# EAGLE schematic IOTBee-v1.1 (EAGLE 6.6.0)
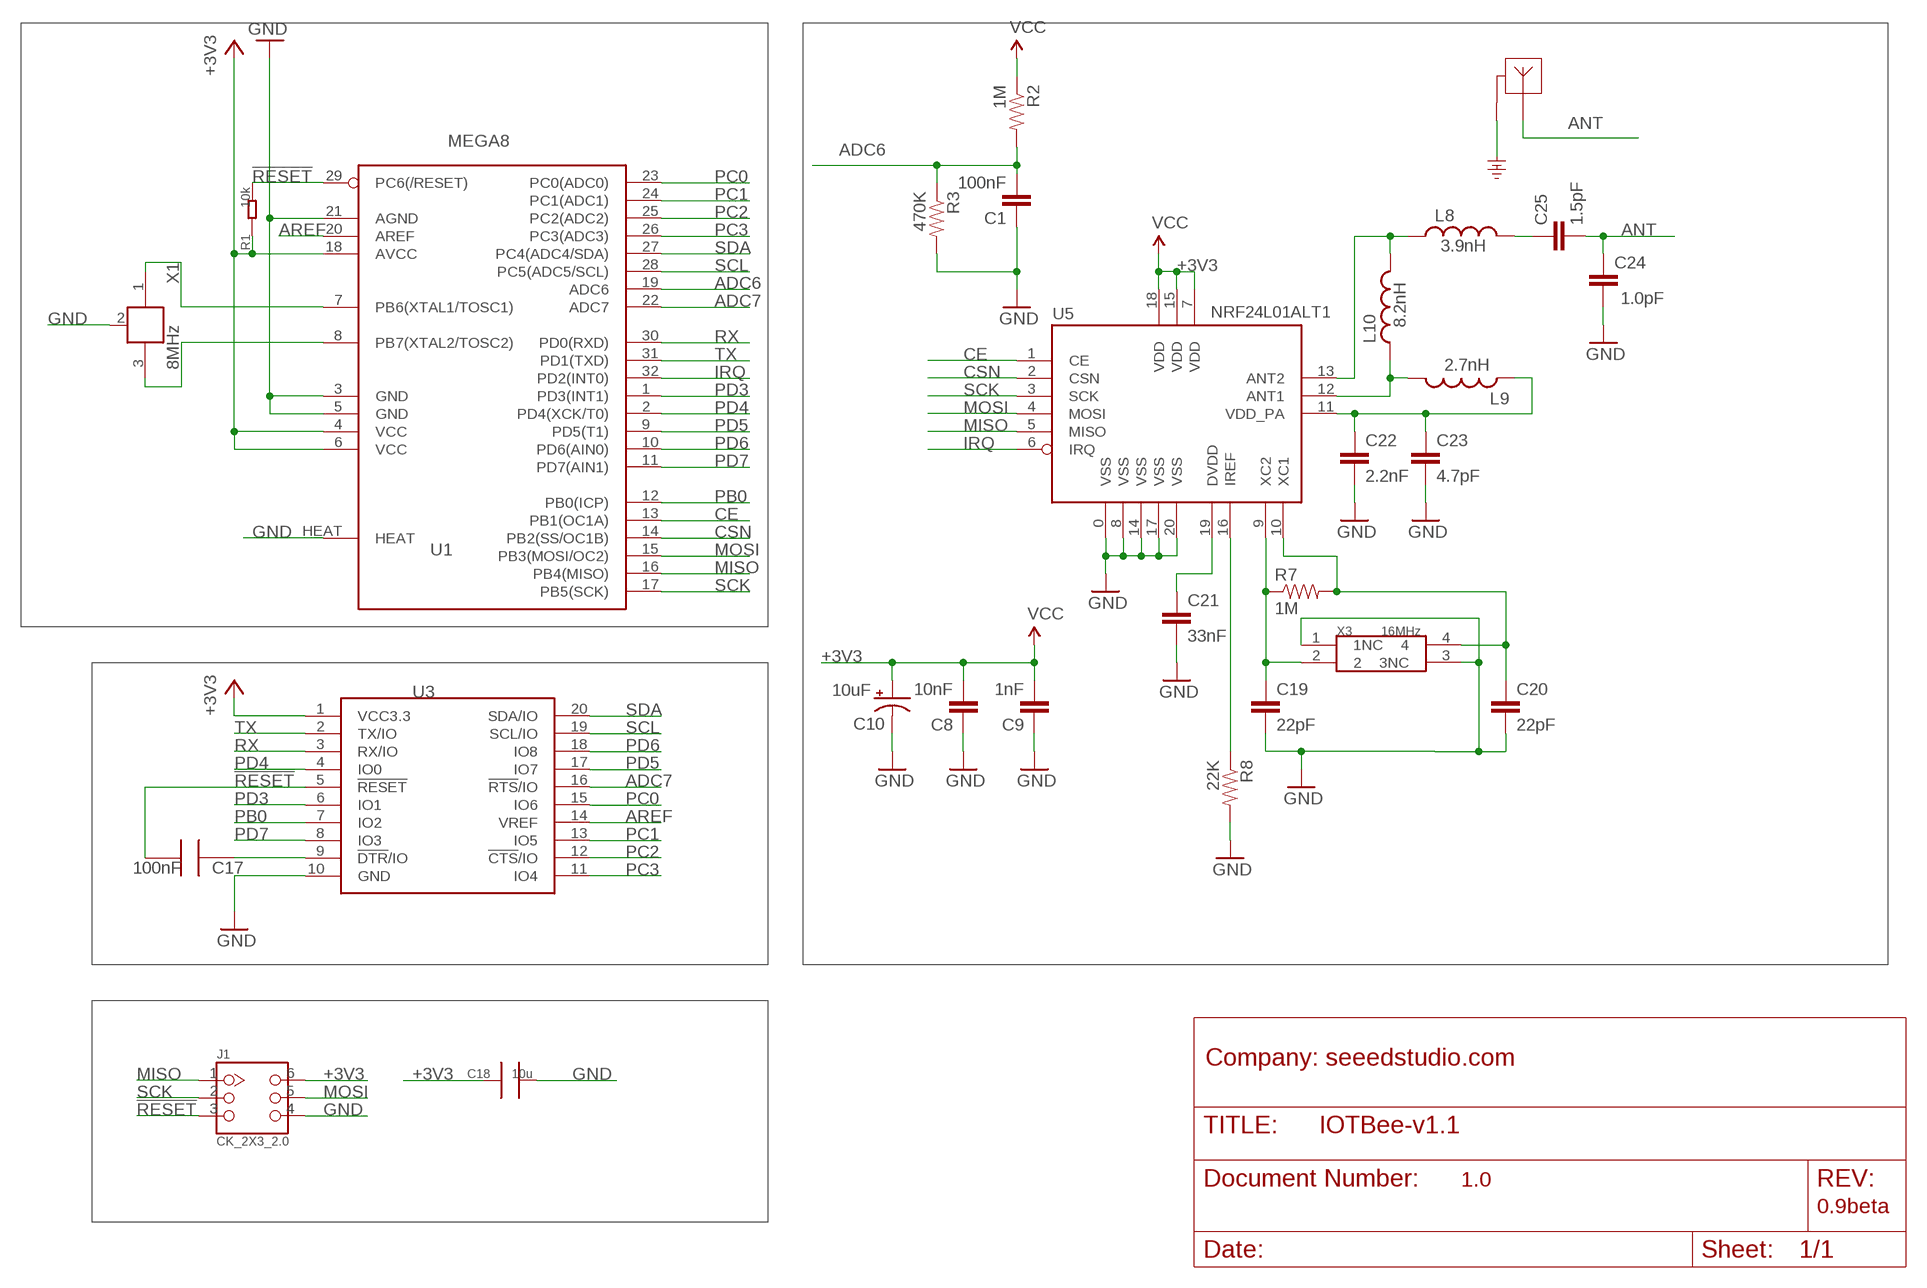
[diagram p0: schematic, sheet 1]

## Parts
ANT1  2.4G-ANT  [2.4G-ANT]
C1  100nF  CAP0402-CAP  [0402-CAP]
C8  10nF  CAP0402-CAP  [0402-CAP]
C9  1nF  CAP0402-CAP  [0402-CAP]
C10  10uF  CAP_POL3528  [EIA3528]
C17  100nF  C0603_S  [0603_S]
C18  10u  C0805  [0805]
C19  22pF  CAP0402-CAP  [0402-CAP]
C20  22pF  CAP0402-CAP  [0402-CAP]
C21  33nF  CAP0402-CAP  [0402-CAP]
C22  2.2nF  CAP0402-CAP  [0402-CAP]
C23  4.7pF  CAP0402-CAP  [0402-CAP]
C24  1.0pF  CAP0402-CAP  [0402-CAP]
C25  1.5pF  CAP0402-CAP  [0402-CAP]
J1  CK_2X3_2.0  [CK_2X3_2.0]
L8  3.9nH  INDUCTOR0402  [C0402]
L9  2.7nH  INDUCTOR0402  [C0402]
L10  8.2nH  INDUCTOR0402  [C0402]
R1  10k  R0603_S  [0603_S]
R2  1M  RESISTOR0402-RES  [0402-RES]
R3  470K  RESISTOR0402-RES  [0402-RES]
R7  1M  RESISTOR0402-RES  [0402-RES]
R8  22K  RESISTOR0402-RES  [0402-RES]
U1  MEGA8  [MLF32X]
U3  BEE-OPENBEE-BTSMD  [20P-SMD-2.0-BT]
U5  NRF24L01ALT1  [QFN20_ALT1]
X1  8MHz  XTAL_NCVER  [XTAL_3X2]
X3  16MHz  XTAL_SMD_3225  [X3225]

## Nets
!RESET: C17.2 J1.3 R1.2 U1.29(PC6(/RESET)) U3.5(!RESET)
+3V3: C8.2 C9.2 C10.A(+) C18.1 J1.6 R1.1 R2.1 U1.4(VCC) U1.6(VCC) U1.18(AVCC) U3.1(VCC3.3) U5.7(VDD) U5.15(VDD) U5.18(VDD) ; supply symbol labelled VCC
ADC6: C1.2 R2.2 R3.1 U1.19(ADC6)
ADC7: U1.22(ADC7) U3.16(!RTS!/IO)
ANT: ANT1.2 C24.2 C25.2
AREF: U1.20(AREF) U3.14(VREF)
CE: U1.13(PB1(OC1A)) U5.1(CE)
CSN: U1.14(PB2(SS/OC1B)) U5.2(CSN)
DTR: C17.1 U3.9(!DTR!/IO)
GND: ANT1.1 C1.1 C8.1 C9.1 C10.C(-) C18.2 C19.2 C20.2 C21.2 C22.2 C23.2 C24.1 J1.4 R3.2 R8.2 U1.3(GND) U1.5(GND) U1.21(AGND) U1.HEAT U3.10(GND) U5.0(VSS) U5.8(VSS) U5.14(VSS) U5.17(VSS) U5.20(VSS) X1.2(GND) X3.1(1NC) X3.3(3NC)
IRQ: U1.32(PD2(INT0)) U5.6(IRQ)
MISO: J1.1 U1.16(PB4(MISO)) U5.5(MISO)
MOSI: J1.5 U1.15(PB3(MOSI/OC2)) U5.4(MOSI)
N$11: U1.7(PB6(XTAL1/TOSC1)) X1.1
N$13: U1.8(PB7(XTAL2/TOSC2)) X1.3
N$19: C19.1 R7.1 U5.9(XC2) X3.2
N$20: C20.1 R7.2 U5.10(XC1) X3.4
N$22: L8.1 L10.2 U5.13(ANT2)
N$23: C22.1 C23.1 L9.1 U5.11(VDD_PA)
N$24: R8.1 U5.16(IREF)
N$25: C21.1 U5.19(DVDD)
N$26: L9.2 L10.1 U5.12(ANT1)
N$27: C25.1 L8.2
PB0: U1.12(PB0(ICP)) U3.7(IO2)
PC0: U1.23(PC0(ADC0)) U3.15(IO6)
PC1: U1.24(PC1(ADC1)) U3.13(IO5)
PC2: U1.25(PC2(ADC2)) U3.12(!CTS!/IO)
PC3: U1.26(PC3(ADC3)) U3.11(IO4)
PD3: U1.1(PD3(INT1)) U3.6(IO1)
PD4: U1.2(PD4(XCK/T0)) U3.4(IO0)
PD5: U1.9(PD5(T1)) U3.17(IO7)
PD6: U1.10(PD6(AIN0)) U3.18(IO8)
PD7: U1.11(PD7(AIN1)) U3.8(IO3)
RX: U1.30(PD0(RXD)) U3.3(RX/IO)
SCK: J1.2 U1.17(PB5(SCK)) U5.3(SCK)
SCL: U1.28(PC5(ADC5/SCL)) U3.19(SCL/IO)
SDA: U1.27(PC4(ADC4/SDA)) U3.20(SDA/IO)
TX: U1.31(PD1(TXD)) U3.2(TX/IO)

## Notes on the sheet
- Company: seeedstudio.com
- 1.0
- 0.9beta

## Library data of the parts
ANT1 = template (quxiaohui quxiaohui 的冲突副本 2013-09-17):2.4G-ANT
C1 C8 C9 C19-C25 = SparkFun:CAP: Capacitor Standard 0603 ceramic capacitor, and 0.1" leaded capacitor.
C10 = SparkFun:CAP_POL: Capacitor Polarized These are standard SMD and PTH capacitors. Normally 10uF, 47uF, and 100uF in electrolytic and tantalum varieties. Always verify the external diameter of the through hole cap, it varies with capacity, voltage, and manufacturer. The EIA devices should be standard.
C17 = CPT_SMD:C0603
C18 = CPT_SMD:C0805
J1 = CONNECTER:CK_2X3
L8-L10 = SparkFun:INDUCTOR: Inductors Basic Inductor/Choke - 0603 and 1206. Footprints are not proven and vary greatly between part numbers.
R1 = CPT_SMD:R0603
R2 R3 R7 R8 = SparkFun:RESISTOR: Resistor Basic schematic elements and footprints for 0603, 1206, and PTH resistors.
U1 = ICs_v54:MEGA8
U3 = Duinopeak-Module:BEE-OPENBEE
U5 = Testing:NRF24L01: 2.4GHz Low Power Transceiver This is the very popular, low cost, very low power RF transceiver from Nordic Semiconductor. Simple SPI interface. SKU: COM-00690
X1 = CPT_SMD:XTAL_NC
X3 = CPT_SMD:XTAL_SMD